# EasyEDA Pro project ProPrj_ZC95_FrontPanelControls_v1_1.epro

# Schematic Schematic1
Board Name: Board1; Create Date: 2026-02-20; Page Name: P1; Project Name: ZC95_FrontPanelControls_v1_1; Schematic Name: Schematic1; Update Date: 2026-08-01; Company: EasyEDA.com; Page Size: A4; Version: V1.1
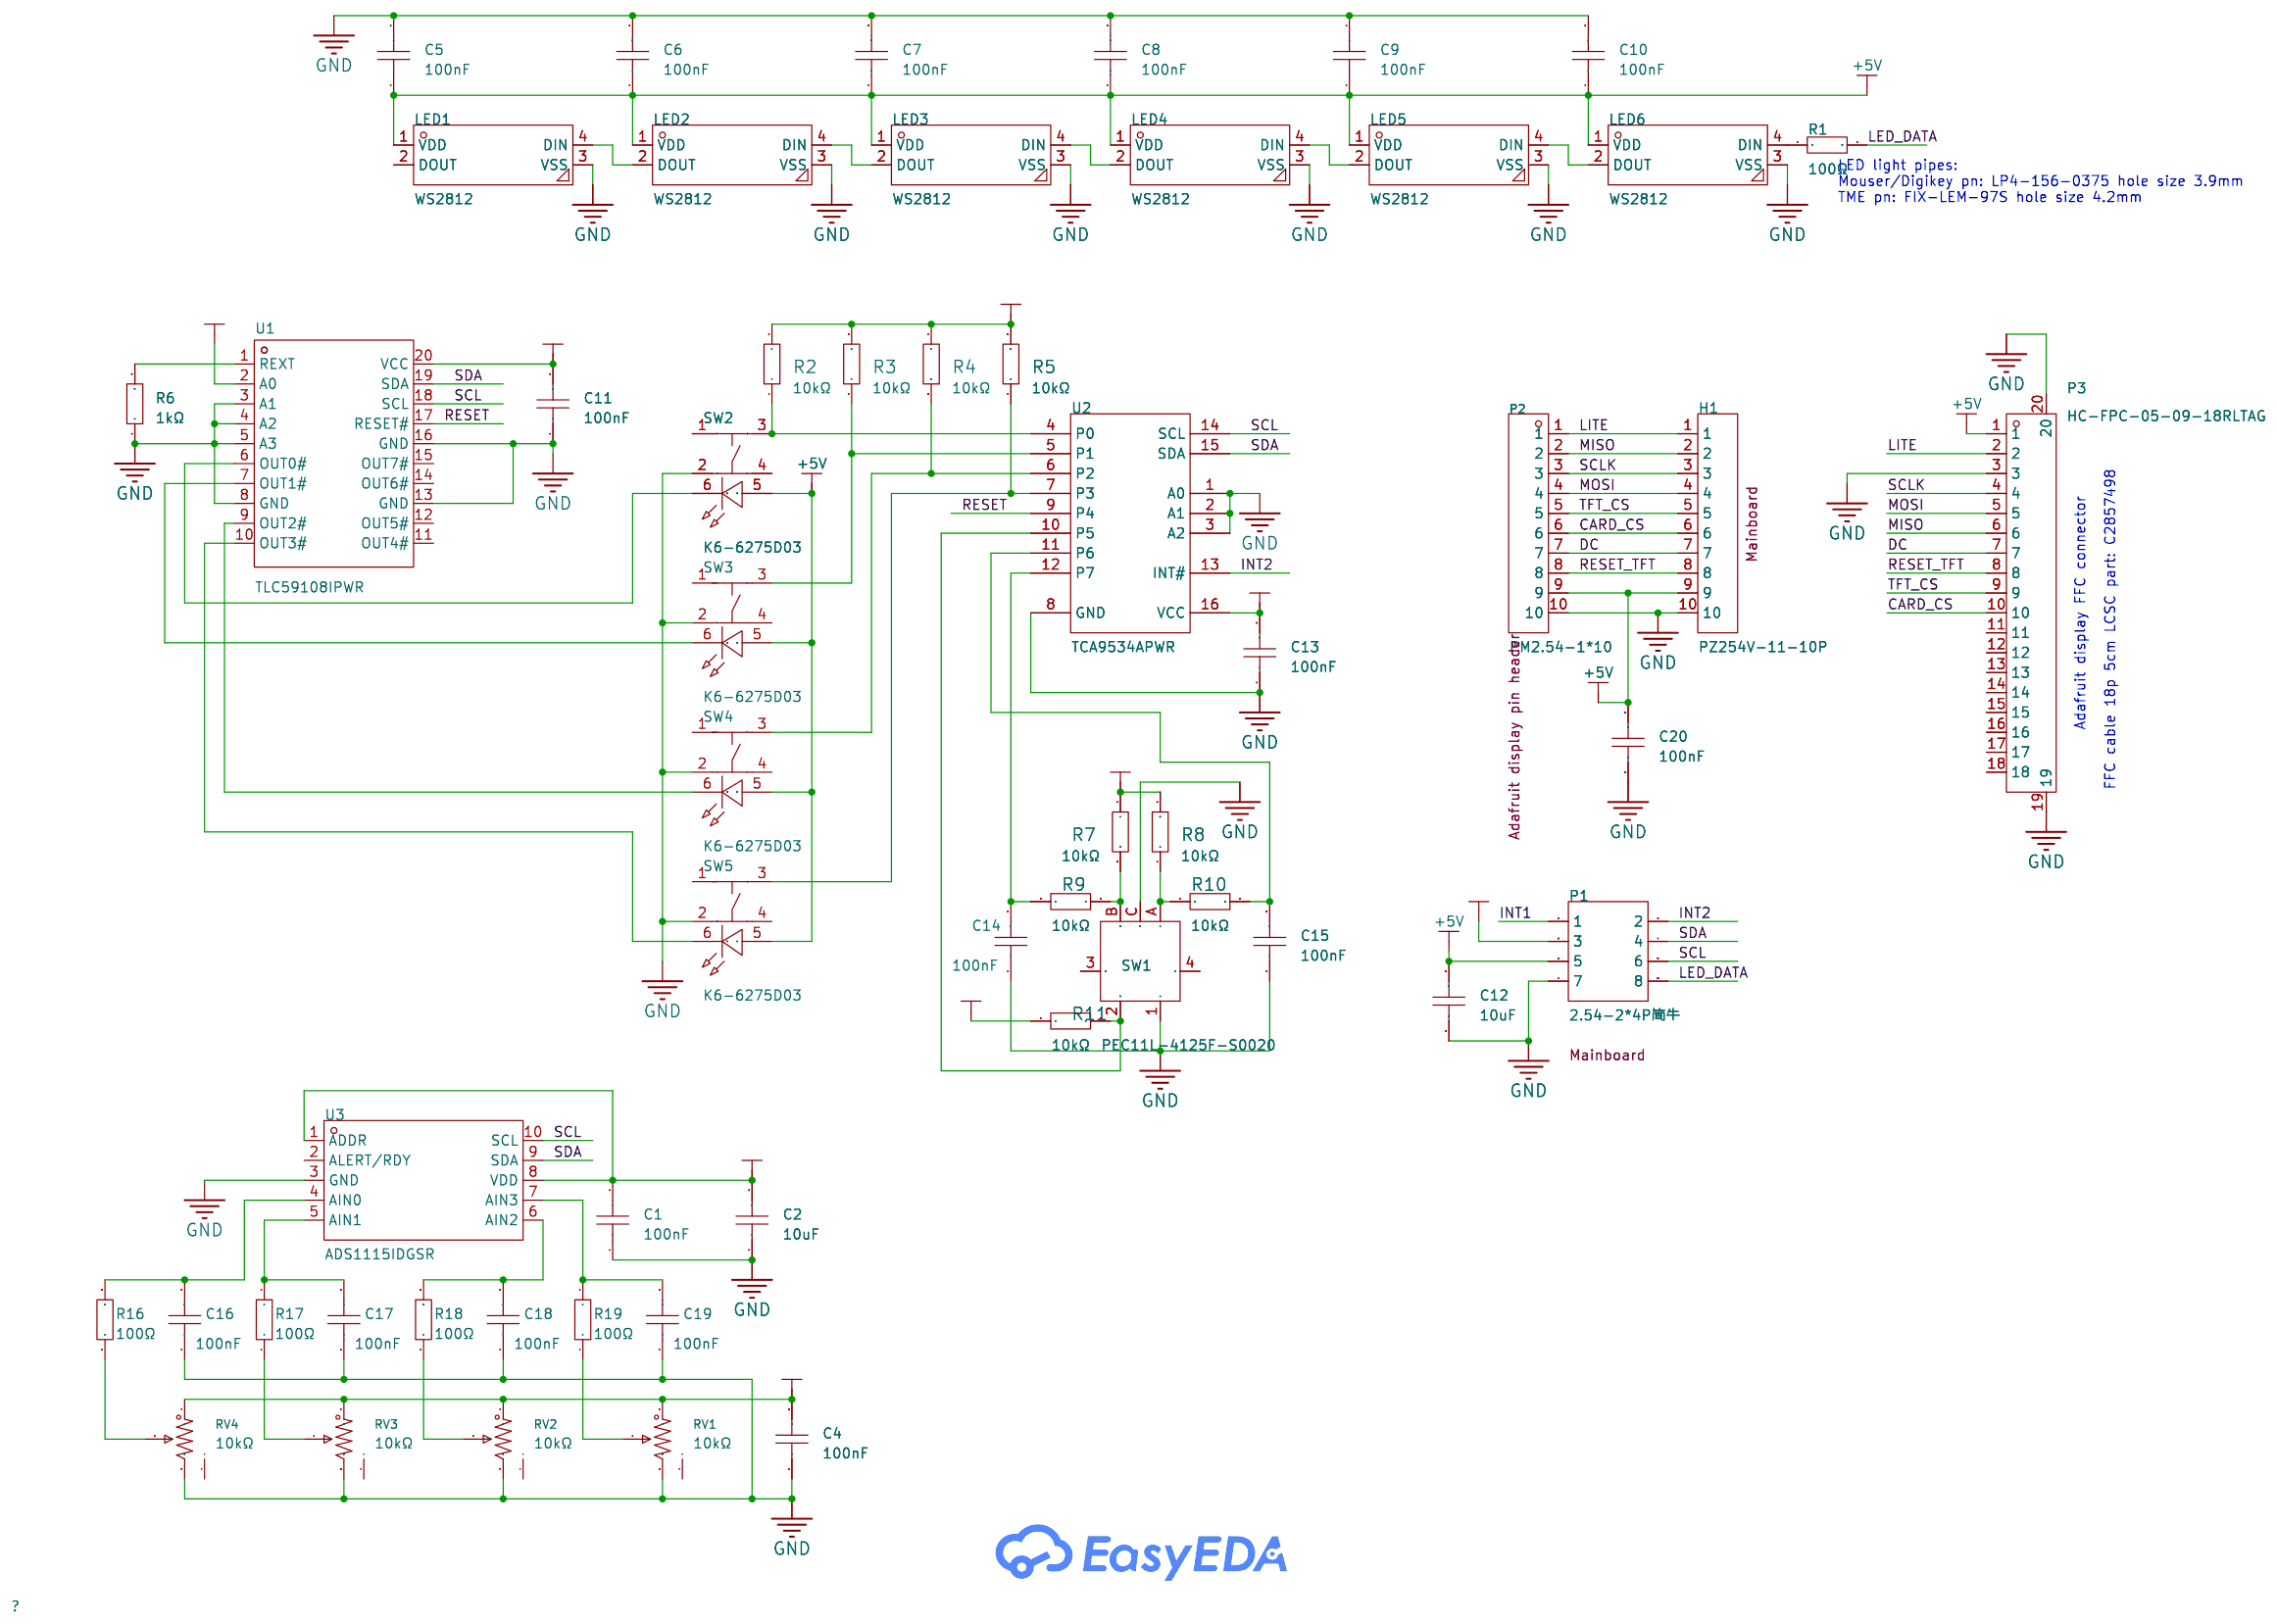
[diagram p0: schematic sheet]

## Parts
C1  100nF  [C0603]
C2  10uF  [C0603]
C4  100nF  [C0603]
C5  100nF  [C0603]
C6  100nF  [C0603]
C7  100nF  [C0603]
C8  100nF  [C0603]
C9  100nF  [C0603]
C10  100nF  [C0603]
C11  100nF  [C0603]
C12  10uF  [C0603]
C13  100nF  [C0603]
C14  100nF  [C0603]
C15  100nF  [C0603]
C16  100nF  [C0603]
C17  100nF  [C0603]
C18  100nF  [C0603]
C19  100nF  [C0603]
C20  100nF  [C0603]
H1  PZ254V-11-10P  [HDR-TH_10P-P2.54-V-M]
LED1  WS2812  [LED-SMD_4P-L5.0-W5.0-TL_WS2812B-B]
LED2  WS2812  [LED-SMD_4P-L5.0-W5.0-TL_WS2812B-B]
LED3  WS2812  [LED-SMD_4P-L5.0-W5.0-TL_WS2812B-B]
LED4  WS2812  [LED-SMD_4P-L5.0-W5.0-TL_WS2812B-B]
LED5  WS2812  [LED-SMD_4P-L5.0-W5.0-TL_WS2812B-B]
LED6  WS2812  [LED-SMD_4P-L5.0-W5.0-TL_WS2812B-B]
P1  2.54-2*4P简牛  [IDC-TH_8P-P2.54-V-R2-C4-S2.54]
P2  PM2.54-1*10  [HDR-TH_10P-P2.54-V-F]
P3  HC-FPC-05-09-18RLTAG  [FPC-SMD_18P-P0.50_HC-FPC-05-09-18RLTAG]
R1  100Ω  [R0603]
R2  10kΩ  [R0603]
R3  10kΩ  [R0603]
R4  10kΩ  [R0603]
R5  10kΩ  [R0603]
R6  1kΩ  [R0603]
R7  10kΩ  [R0603]
R8  10kΩ  [R0603]
R9  10kΩ  [R0603]
R10  10kΩ  [R0603]
R11  10kΩ  [R0603]
R16  100Ω  [R0603]
R17  100Ω  [R0603]
R18  100Ω  [R0603]
R19  100Ω  [R0603]
RV1  10kΩ  [RES-ADJ-TH_RK09L1140A65]
RV2  10kΩ  [RES-ADJ-TH_RK09L1140A65]
RV3  10kΩ  [RES-ADJ-TH_RK09L1140A65]
RV4  10kΩ  [RES-ADJ-TH_RK09L1140A65]
SW1  PEC11L-4125F-S0020  [SW-TH_PEC11L-4125F-S0020]
SW2  K6-6275D03  [SW-TH_K6-6275D03]
SW3  K6-6275D03  [SW-TH_K6-6275D03]
SW4  K6-6275D03  [SW-TH_K6-6275D03]
SW5  K6-6275D03  [SW-TH_K6-6275D03]
U1  TLC59108IPWR  [TSSOP-20_L6.5-W4.4-P0.65-LS6.4-BL]
U2  TCA9534APWR  [TSSOP-16_L5.0-W4.4-P0.65-LS6.4-BL]
U3  ADS1115IDGSR  [MSOP-10_L3.0-W3.0-P0.50-LS5.0-BL]

## Library data of the parts
C1 C4-C11 C13-C20 = CC0603KRX7R9BB104: Capacitance:100nF Tolerance:±10% Tolerance:±10% Voltage Rating:50V Temperature Coefficient:X7R; LCSC Part Name: 100nF ±10% 50V; Supplier Part: C14663; Manufacturer: YAGEO(国巨); Supplier Footprint: 0603; JLCPCB Part Class: Basic Part; Datasheet: https://item.szlcsc.com/datasheet/CC0603KRX7R9BB104/15331.html; Supplier: LCSC; Tolerance: ±10%; Voltage Rating: 50V; Temperature Coefficient: X7R
C2 C12 = CL10A106KP8NNNC: Capacitance:10uF Tolerance:±10% Tolerance:±10% Voltage Rating:10V Temperature Coefficient:X5R; LCSC Part Name: 10uF ±10% 10V; Supplier Part: C19702; Manufacturer: SAMSUNG(三星); Supplier Footprint: 0603; JLCPCB Part Class: Basic Part; Datasheet: https://item.szlcsc.com/datasheet/CL10A106KP8NNNC/20411.html; Supplier: LCSC; Tolerance: ±10%; Voltage Rating: 10V; Temperature Coefficient: X5R
H1 = PZ254V-11-10P: Pin Structure:1x10P Pitch:2.54mm Row Spacing:- Circluar Pins/Square Pins:Policy Mounting Type:Straight Number of Rows:Single Row Number of Pins:10P Current Rating:- Voltage Rating (Max):- Length of Mating Pin:6mm Insulation Height:2.5mm Length of End Conn; LCSC Part Name: 1x10P 间距:2.54mm 方针 直插; Supplier Part: C492409; Manufacturer: XFCN(兴飞); Supplier Footprint: 插件,P=2.54mm; JLCPCB Part Class: Extended Part; Datasheet: https://atta.szlcsc.com/upload/public/pdf/source/20200309/C492409_129C9431BDD62EBBBD0A643B6AAB9FBD.pdf; Supplier: LCSC; Pin Structure: 1x10P; Pitch: 2.54mm; Circluar Pins/Square Pins: Policy; Mounting Type: Straight; Number of Rows: Single Row; Number of Pins: 10P; Length of Mating Pin: 6mm; Insulation Height: 2.5mm; Length of End Connection Pin: 3mm; Contact Material: Brass; Operating Temperature: -40℃~+105℃; Color: Black; Comment: Mainboard
LED1-LED6 = WS2812B-B/T: Wavelength:520nm；471nm；621nm Luminous Intensity:R:300mcd~500mcd；B:200mcd~300mcd；G:600mcd~1000mcd Fixed-Frequency Pwm Mode:2kHz Data Transmission Rate:800Kbit/s Voltage - Supply:- Voltage - Supply:- Quiescent Current:0.6mA Lens Color:- Peak Wavelength:G:52; LCSC Part Name: RGB三色; Supplier Part: C5380881; Manufacturer: worldsemi; Supplier Footprint: SMD5050-4P; JLCPCB Part Class: Extended Part; Datasheet: https://item.szlcsc.com/datasheet/WS2812B-B%252FT/2886707.html; Supplier: LCSC; Wavelength: 520nm；471nm；621nm; Luminous Intensity: R:300mcd~500mcd；B:200mcd~300mcd；G:600mcd~1000mcd; Fixed-Frequency Pwm Mode: 2kHz; Data Transmission Rate: 800Kbit/s; Quiescent Current: 0.6mA; Peak Wavelength: G:520nm；R:621nm；B:471nm; Length: 5mm; Width: 1.57mm; Height: 5.4mm; Check: false
P1 = 2.54-2*4P简牛: Connector Type:IDC Header Pitch:2.54mm Number of Positions or Pins:2x4P Current Rating:1A Holder Type:Through Hole Row Spacing:2.54mm Number of Rows:2 Number of PINs Per Row:4 Contact Material:Brass Contact Plating:Gold Operating Temperature:-55℃~+105℃ Op; LCSC Part Name: 2.54mm 2x4P 排数:2 每排P数:4; Supplier Part: C9135; Manufacturer: BOOMELE(博穆精密); Supplier Footprint: 插件,P=2.54mm; JLCPCB Part Class: Extended Part; Datasheet: https://item.szlcsc.com/datasheet/2.54-2*4P%25E7%25AE%2580%25E7%2589%259B/9658.html; Supplier: LCSC; Connector Type: IDC Header; Pitch: 2.54mm; Number of Positions or Pins: 2x4P; Current Rating: 1A; Holder Type: Through Hole; Row Spacing: 2.54mm; Number of Rows: 2; Number of PINs Per Row: 4; Contact Material: Brass; Contact Plating: Gold; Operating Temperature: -55℃~+105℃; Color: Black; Comment: Mainboard
P2 = PM2.54-1*10: Holes Structure:1x10P Pitch:2.54mm Row Spacing:2.54mm Circular Hole / Square Hole:Square Hole Mounting Type:Through Hole Number of Rows:1 Number of Positions:10P Current Rating:2.5A Holes Direction:Top Insulation Height:8.5mm Operating Temperature:-40℃~+1; LCSC Part Name: 间距:2.54mm 1x10P 直插; Supplier Part: C5116489; Manufacturer: ZHOURI(洲日); Supplier Footprint: 插件,P=2.54mm; JLCPCB Part Class: Extended Part; Datasheet: https://item.szlcsc.com/datasheet/PM2.54-1*10/5692732.html; Supplier: LCSC; Holes Structure: 1x10P; Pitch: 2.54mm; Row Spacing: 2.54mm; Circular Hole / Square Hole: Square Hole; Mounting Type: Through Hole; Number of Rows: 1; Number of Positions: 10P; Current Rating: 2.5A; Holes Direction: Top; Insulation Height: 8.5mm; Operating Temperature: -40℃~+105℃; Comment: Adafruit display pin header
P3 = HC-FPC-05-09-18RLTAG: Locking Feature:Clamshell Contact Type:Double-sided contacts/up and down connection Number of Contacts:18P Pitch:0.5mm Mounting Type:卧贴 FFC, FCB Thickness:0.3mm FFC, FCB Thickness:0.3mm Height Above Board:1mm Contact Material:Copper Alloy Operating Temper; LCSC Part Name: 翻盖式 双侧触点/上下接 P数:18P 间距:0.5mm; Supplier Part: C5213754; Manufacturer: HCTL(华灿天禄); Supplier Footprint: SMD,P=0.5mm,卧贴; JLCPCB Part Class: Extended Part; Datasheet: https://atta.szlcsc.com/upload/public/pdf/source/20221026/52A26161A88FCE07A06989F8D4399614.pdf; Supplier: LCSC; Locking Feature: Clamshell; Contact Type: Double-sided contacts/up and down connection; Number of Contacts: 18P; Pitch: 0.5mm; Mounting Type: 卧贴; FFC, FCB Thickness: 0.3mm; Height Above Board: 1mm; Contact Material: Copper Alloy; Operating Temperature Range: -55℃~+85℃
R1 R16-R19 = 0603WAF1000T5E: Type:Thick Film Resistors Resistance: Tolerance:±1% Tolerance:±1% Power(Watts): Overload Voltage (Max): Temperature Coefficient:±200ppm/℃ Temperature Coefficient:±200ppm/℃ Operating Temperature Range:-55℃~+155℃ Operating Temperature Range:-55℃~+155℃; LCSC Part Name: 100Ω ±1% 100mW 厚膜电阻; Supplier Part: C22775; Manufacturer: UNI-ROYAL(厚声); Supplier Footprint: 0603; JLCPCB Part Class: Basic Part; Datasheet: https://atta.szlcsc.com/upload/public/pdf/source/20200306/C422600_1E6D84923E4A46A82E41ADD87F860B5C.pdf; Supplier: LCSC; Type: Thick Film Resistors; Tolerance: ±1%; Temperature Coefficient: ±200ppm/℃; Operating Temperature Range: -55℃~+155℃
R2-R5 R7-R11 = 0603WAF1002T5E: Type:Thick Film Resistor Resistance:10kΩ Tolerance:±1% Tolerance:±1% Power(Watts):100mW Voltage-Supply(Max):75V Temperature Coefficient:±100ppm/℃ Temperature Coefficient:±100ppm/℃ Operating Temperature:-55℃~+155℃ Operating Temperature:-55℃~+155℃; LCSC Part Name: 厚膜电阻 10kΩ ±1% 100mW; Supplier Part: C25804; Manufacturer: UNI-ROYAL(厚声); Supplier Footprint: 0603; JLCPCB Part Class: Basic Part; Datasheet: https://item.szlcsc.com/datasheet/0603WAF1002T5E/26547.html; Supplier: LCSC; Type: Thick Film Resistor; Tolerance: ±1%; Power(Watts): 100mW; Voltage-Supply(Max): 75V; Temperature Coefficient: ±100ppm/℃; Operating Temperature: -55℃~+155℃
R6 = 0603WAF1001T5E: Type:Thick Film Resistor Resistance:1kΩ Tolerance:±1% Tolerance:±1% Power(Watts):100mW Voltage-Supply(Max):75V Temperature Coefficient:±100ppm/℃ Temperature Coefficient:±100ppm/℃ Operating Temperature:-55℃~+155℃ Operating Temperature:-55℃~+155℃; LCSC Part Name: 1kΩ ±1% 100mW 厚膜电阻; Supplier Part: C21190; Manufacturer: UNI-ROYAL(厚声); Supplier Footprint: 0603; JLCPCB Part Class: Basic Part; Datasheet: https://item.szlcsc.com/datasheet/0603WAF1001T5E/21904.html; Supplier: LCSC; Type: Thick Film Resistor; Tolerance: ±1%; Power(Watts): 100mW; Voltage-Supply(Max): 75V; Temperature Coefficient: ±100ppm/℃; Operating Temperature: -55℃~+155℃
RV1-RV4 = RK09L1140A2U: Resistance:10kΩ Tolerance:±20% Tolerance:±20% Voltage Rating:10V Power(Watts):50mW Number of Turns:-; LCSC Part Name: 三件套 10kΩ ±20%; Supplier Part: C470448; Manufacturer: ALPSALPINE(阿尔卑斯阿尔派); Supplier Footprint: 插件; JLCPCB Part Class: Extended Part; Datasheet: https://item.szlcsc.com/datasheet/RK09L1140A2U/476528.html; Supplier: LCSC; Tolerance: ±20%; Voltage Rating: 10V; Power(Watts): 50mW
SW1 = PEC11L-4125F-S0020: LCSC Part Name: 三件套 PEC11L-4125F-S0020（三件套）; Supplier Part: C143783; Manufacturer: BOURNS; Supplier Footprint: 插件; JLCPCB Part Class: Extended Part; Datasheet: https://item.szlcsc.com/datasheet/PEC11L-4125F-S0020/155114.html; Supplier: LCSC
SW2-SW5 = K6-6275D03: Operating Force:1.6N Mounting Type:Through Hole Length:9mm Width:9mm Switch Height:15.35mm Contact Current:50mA Voltage Rating:12V With Lamp:Blue Life:100,000 Cycles Operating Temperature:-25℃~+85℃ Operating Temperature:-25℃~+85℃; LCSC Part Name: 蓝色带灯开关; Supplier Part: C693828; Manufacturer: 韩国韩荣; Supplier Footprint: 插件,9x9mm; JLCPCB Part Class: Extended Part; Datasheet: https://item.szlcsc.com/datasheet/K6-6275D03/726368.html; Supplier: LCSC; Operating Force: 1.6N; Mounting Type: Through Hole; Length: 9mm; Width: 9mm; Switch Height: 15.35mm; Contact Current: 50mA; Voltage Rating: 12V; With Lamp: Blue; Life: 100,000 Cycles; Operating Temperature: -25℃~+85℃
U1 = TLC59108IPWR: Type:- Voltage - Input(DC):3V~5.5V Voltage - Input(DC):3V~5.5V Frequency - Switching:25MHz Frequency - Switching:25MHz Number of Channels:8 Output Voltage:17V Output Voltage:17V Output Current:120mA Dimming:PWM；I2C Features:Over-Temperature Protection (OT; LCSC Part Name: 8位调频+ I²C总线恒流LED灌电流驱动器; Supplier Part: C130031; Manufacturer: TI(德州仪器); Supplier Footprint: TSSOP-20; JLCPCB Part Class: Extended Part; Datasheet: https://www.ti.com/cn/lit/gpn/tlc59108; Supplier: LCSC; Voltage - Input(DC): 3V~5.5V; Frequency - Switching: 25MHz; Number of Channels: 8; Output Voltage: 17V; Output Current: 120mA; Dimming: PWM；I2C; Features: Over-Temperature Protection (OTP); Operating temperature: -40℃~+85℃; Switch Tube (Built-In/External): Built-in; Constant Current Accuracy: 8%
U2 = TCA9534APWR: Interface:I2C；SMBus Number of I/O:8 Interrupt Output:With Interrupt Output Output Type:- Voltage - Supply:1.65V~5.5V Voltage - Supply:1.65V~5.5V Current - Output Low(IOL):- Current - Output High(IOH):- Clock Frequency:400kHz Operating Temperature:-40℃~+85; LCSC Part Name: TCA9534A 低电压8位I²C和SMBUS低功耗I/O扩展器，带中断输出和配置寄存器; Supplier Part: C206010; Manufacturer: TI(德州仪器); Supplier Footprint: TSSOP-16; JLCPCB Part Class: Extended Part; Datasheet: https://www.ti.com/cn/lit/gpn/tca9534a; Supplier: LCSC; Interface: I2C；SMBus; Number of I/O: 8; Interrupt Output: With Interrupt Output; Voltage - Supply: 1.65V~5.5V; Clock Frequency: 400kHz; Operating Temperature: -40℃~+85℃
U3 = ADS1115IDGSR: Resolution(Bits):16 Sampling Rate:- number of channels:2 Voltage - Supply:2V~5.5V Voltage - Supply:2V~5.5V Interface:I2C differential input:Yes Integral non - linearity:1LSB Integral non - linearity:1LSB Operating Temperature:-40℃~+125℃ Operating Temperat; LCSC Part Name: 具有内部基准、振荡器和可编程比较器且兼容 I2C 的ADS111x、超小型、低功耗 860SPS、16位ADC; Supplier Part: C37593; Manufacturer: TI(德州仪器); Supplier Footprint: VSSOP-10; JLCPCB Part Class: Extended Part; Datasheet: https://www.ti.com/cn/lit/gpn/ads1115; Supplier: LCSC; Resolution(Bits): 16; number of channels: 2; Voltage - Supply: 2V~5.5V; Interface: I2C; differential input: Yes; Integral non - linearity: 1LSB; Operating Temperature: -40℃~+125℃; Clock/Oscillator: Built-in; Voltage Reference: Built-in; Programmable Gain: Support; ADC architecture: Sigma-Delta; Data rate: 128Hz；8Hz；64Hz；16Hz；32Hz；250Hz；475Hz；860Hz; Quiescent Current (Iq): 500nA; Full-Scale Range(FSR): 2.048V

## Nets
+3V3: C1.2 C2.2 C4.2 C11.2 C13.2 P1.3 R2.2 R3.2 R4.1 R5.2 R7.1 R8.2 R11.1 RV1.1 RV2.1 RV3.1 RV4.1 U1.2(A0) U1.20(VCC) U2.16(VCC) U3.1(ADDR) U3.8(VDD)
+5V: C5.1 C6.1 C7.1 C8.1 C9.1 C10.1 C12.2 C20.2 H1.9 LED1.1(VDD) LED2.1(VDD) LED3.1(VDD) LED4.1(VDD) LED5.1(VDD) LED6.1(VDD) P1.5 P2.9 P3.1 SW2.5 SW3.5 SW4.5 SW5.5
GND: C1.1 C2.1 C4.1 C5.2 C6.2 C7.2 C8.2 C9.2 C10.2 C11.1 C12.1 C13.1 C14.1 C15.1 C16.1 C17.1 C18.1 C19.1 C20.1 H1.10 LED1.3(VSS) LED2.3(VSS) LED3.3(VSS) LED4.3(VSS) LED5.3(VSS) LED6.3(VSS) P1.7 P2.10 P3.3 P3.19 P3.20 R6.1 RV1.3 RV2.3 RV3.3 RV4.3 SW1.1 SW1.C SW2.2 SW3.2 SW4.2 SW5.2 U1.3(A1) U1.4(A2) U1.5(A3) U1.8(GND) U1.13(GND) U1.16(GND) U2.1(A0) U2.2(A1) U2.3(A2) U2.8(GND) U3.3(GND)
CARD_CS: H1.6 P2.6 P3.10
DC: H1.7 P2.7 P3.7
INT1: P1.1
INT2: P1.2 U2.13(INT#)
LED_DATA: P1.8 R1.2
LITE: H1.1 P2.1 P3.2
MISO: H1.2 P2.2 P3.6
MOSI: H1.4 P2.4 P3.5
RESET: U1.17(RESET#) U2.9(P4)
RESET_TFT: H1.8 P2.8 P3.8
SCL: P1.6 U1.18(SCL) U2.14(SCL) U3.10(SCL)
SCLK: H1.3 P2.3 P3.4
SDA: P1.4 U1.19(SDA) U2.15(SDA) U3.9(SDA)
TFT_CS: H1.5 P2.5 P3.9
$1N1414: LED6.4(DIN) R1.1
$1N1465: LED5.4(DIN) LED6.2(DOUT)
$1N1471: LED4.4(DIN) LED5.2(DOUT)
$1N1478: LED3.4(DIN) LED4.2(DOUT)
$1N1485: LED2.4(DIN) LED3.2(DOUT)
$1N1492: LED1.4(DIN) LED2.2(DOUT)
$1N2339: C16.2 R16.2 U3.4(AIN0)
$1N2349: C17.2 R17.2 U3.5(AIN1)
$1N2354: C18.2 R18.2 U3.6(AIN2)
$1N3651: R6.2 U1.1(REXT)
$1N3862: R11.2 SW1.2 U2.10(P5)
$1N3864: R7.2 R9.2 SW1.B
$1N3866: R8.1 R10.1 SW1.A
$1N3870: C15.2 R10.2 U2.11(P6)
$1N3872: C14.2 R9.1 U2.12(P7)
$1N4065: R2.1 SW2.3 U2.4(P0)
$1N4070: R3.1 SW3.3 U2.5(P1)
$1N4076: R4.2 SW4.3 U2.6(P2)
$1N4082: R5.1 SW5.3 U2.7(P3)
$1N4405: SW2.6 U1.6(OUT0#)
$1N4413: SW3.6 U1.7(OUT1#)
$1N4423: SW4.6 U1.9(OUT2#)
$1N4431: SW5.6 U1.10(OUT3#)
$1N7663: C19.2 R19.2 U3.7(AIN3)
$1N7666: R19.1 RV1.2
$1N7676: R16.1 RV4.2
$1N7681: R17.1 RV3.2
$1N7687: R18.1 RV2.2

Not connected (* = marked no-connect by the designer): LED1 2(DOUT); P3 11 12 13 14 15 16 17 18; RV1 4; RV2 4; RV3 4; RV4 4; SW1 3 4; SW2 1 4; SW3 1 4; SW4 1 4; SW5 1 4; U1 11(OUT4#) 12(OUT5#) 14(OUT6#) 15(OUT7#); U3 2(ALERT/RDY)

## Notes on the sheet
- LED light pipes:
  Mouser/Digikey pn: LP4-156-0375 hole size 3.9mm
  TME pn: FIX-LEM-97S hole size 4.2mm
- Adafruit display FFC connector
- FFC cable 18p 5cm LCSC part: C2857498

# Board PCB1
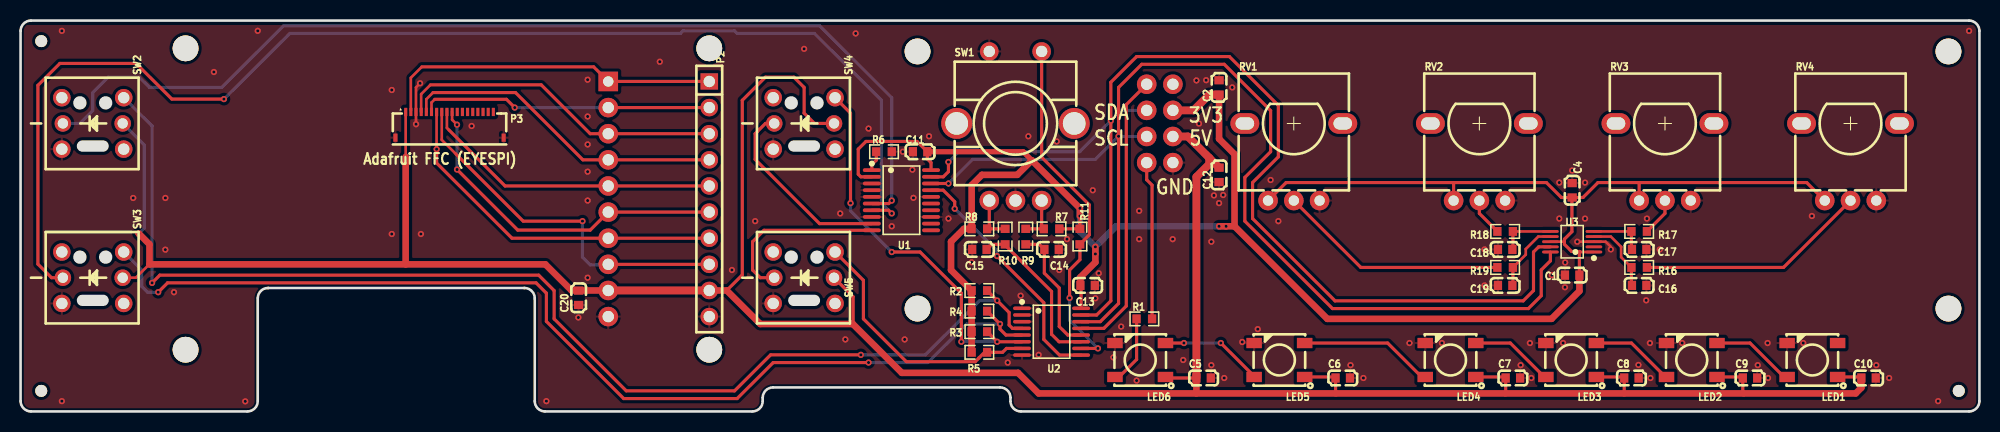
[diagram p1: board, top side]
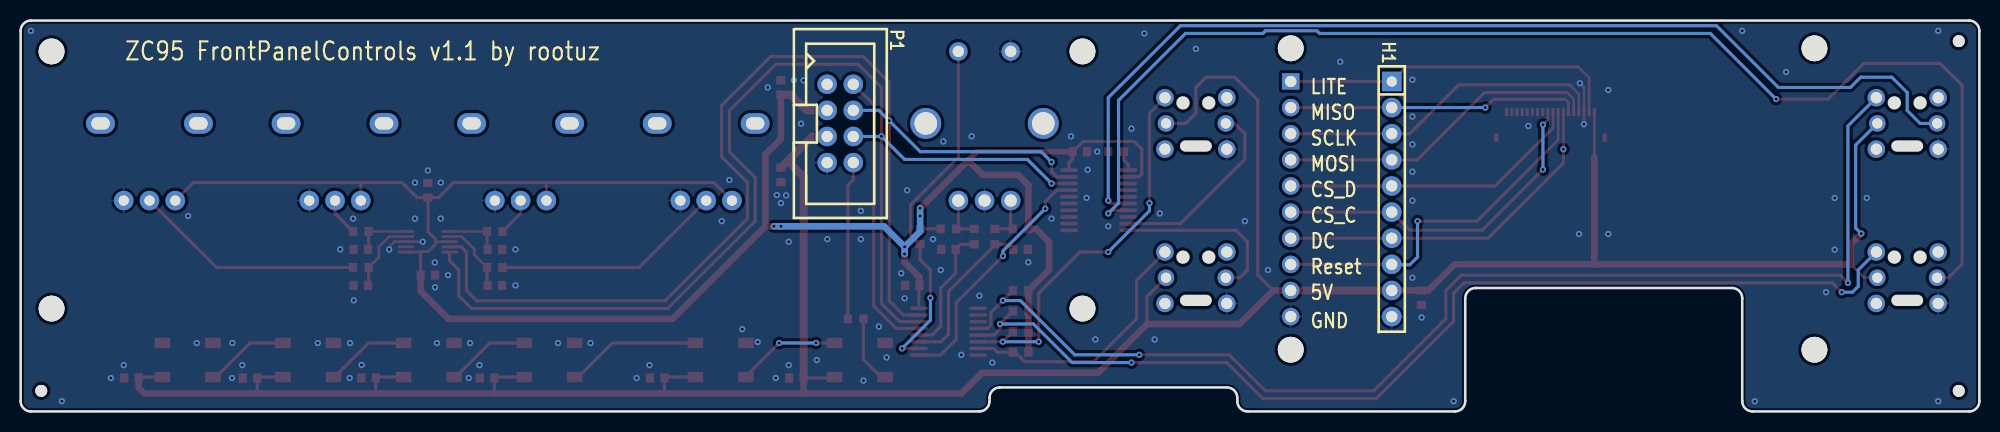
[diagram p2: board, bottom side, seen from below]

Outline 190 x 38 mm; copper layers: Top Layer, Bottom Layer. Coordinates in mm from the lower left corner of the outline.
Outline path: 0,37 arc(0.29,37.71) 1,38 189,38 arc(189.71,37.71) 190,37 190,1 arc(189.71,0.29) 189,0 97.02,0 arc(96.31,0.29) 96.02,1 96.02,1.33 arc(95.72,2.04) 95.02,2.33 72.98,2.33 arc(72.27,2.04) 71.98,1.33 71.98,1 arc(71.69,0.29) 70.98,0 50.87,0 arc(50.16,0.29) 49.87,1 49.87,11 arc(49.58,11.71) 48.87,12 24,12 arc(23.29,11.71) 23,11 23,1 arc(22.71,0.29) 22,0 1,0 arc(0.29,0.29) 0,1 0,37
Stack: Top Layer 0.035mm / Dielectric1 1.51mm FR4 er 4.5 / Bottom Layer 0.035mm

## Design rules (mm)
template: Custom Config
spacing copperThickness1oz (default): track to track 0.102, other pairs 0.152 to 0.3
spacing copperThickness2oz: track to track 0.203, other pairs 0.152 to 0.3
track width copperThickness1oz (default): min 0.127, default 0.305, max 2.54
track width copperThickness2oz: min 0.203, default 0.254, max 2.54
differential pair differentialPair (default): width min 0.127, default 0.254, max 2.54; gap min 0.152, default 0.152
via viaSize (default): diameter min 0.5, default 0.61, max 10; hole min 0.3, default 0.305, max 6.3

## Placement (name value [footprint] x y rotation side)
C1  100nF  [C0603]  150.5 13.25 0 top
C2  10uF  [C0603]  116.25 31.5 270 top
C4  100nF  [C0603]  150.5 21.5 270 top
C5  100nF  [C0603]  114.75 3.25 0 top
C6  100nF  [C0603]  128.25 3.25 0 top
C7  100nF  [C0603]  144.75 3.25 0 top
C8  100nF  [C0603]  156.25 3.25 0 top
C9  100nF  [C0603]  167.75 3.25 0 top
C10  100nF  [C0603]  179.25 3.25 0 top
C11  100nF  [C0603]  87.25 25.25 0 top
C12  10uF  [C0603]  116.25 23 90 top
C13  100nF  [C0603]  103.5 12.25 180 top
C14  100nF  [C0603]  100 15.75 180 top
C15  100nF  [C0603]  93 15.75 0 top
C16  100nF  [C0603]  157 12.25 180 top
C17  100nF  [C0603]  157 15.75 180 top
C18  100nF  [C0603]  144 15.75 0 top
C19  100nF  [C0603]  144 12.25 0 top
C20  100nF  [C0603]  54.13 11.05 90 top
H1  PZ254V-11-10P  [HDR-TH_10P-P2.54-V-M]  57 20.65 270 bottom
LED1  WS2812  [LED-SMD_4P-L5.0-W5.0-TL_WS2812B-B]  173.8 5 180 top
LED2  WS2812  [LED-SMD_4P-L5.0-W5.0-TL_WS2812B-B]  162.1 5 180 top
LED3  WS2812  [LED-SMD_4P-L5.0-W5.0-TL_WS2812B-B]  150.4 5 180 top
LED4  WS2812  [LED-SMD_4P-L5.0-W5.0-TL_WS2812B-B]  138.7 5 180 top
LED5  WS2812  [LED-SMD_4P-L5.0-W5.0-TL_WS2812B-B]  122.1 5 180 top
LED6  WS2812  [LED-SMD_4P-L5.0-W5.0-TL_WS2812B-B]  108.6 5 180 top
NOREF  -  [Pad_e55]  16 35.3 0 top
NOREF#2  -  [Pad_e473]  2 36 0 top
NOREF#3  -  [Pad_e54]  66.8 6 0 top
NOREF#4  -  [Pad_e485]  188 2 0 top
NOREF#5  -  [Pad_e484]  2 2 0 top
NOREF#6  -  [Pad_e68]  87 10 0 top
NOREF#7  -  [Pad_e56]  16 6 0 top
NOREF#8  -  [Pad_e53]  66.8 35.3 0 top
NOREF#9  -  [Pad_e66]  187 10 0 top
NOREF#10  -  [Pad_e67]  87 35 0 top
NOREF#11  -  [Pad_e64]  187 35 0 top
P1  2.54-2*4P简牛  [IDC-TH_8P-P2.54-V-R2-C4-S2.54]  110.5 28 270 bottom
P2  PM2.54-1*10  [HDR-TH_10P-P2.54-V-F]  66.8 20.65 270 top
P3  HC-FPC-05-09-18RLTAG  [FPC-SMD_18P-P0.50_HC-FPC-05-09-18RLTAG]  41.61 27.87 180 top
R1  100Ω  [R0603]  109 9 0 top
R2  10kΩ  [R0603]  93 11.75 180 top
R3  10kΩ  [R0603]  93 9.75 180 top
R4  10kΩ  [R0603]  93 7.75 0 top
R5  10kΩ  [R0603]  93 5.75 180 top
R6  1kΩ  [R0603]  83.75 25.25 180 top
R7  10kΩ  [R0603]  100 17.75 180 top
R8  10kΩ  [R0603]  93 17.75 180 top
R9  10kΩ  [R0603]  97.5 17 90 top
R10  10kΩ  [R0603]  95.5 17 270 top
R11  10kΩ  [R0603]  102.75 17 270 top
R16  100Ω  [R0603]  157 14 180 top
R17  100Ω  [R0603]  157 17.5 180 top
R18  100Ω  [R0603]  144 17.5 0 top
R19  100Ω  [R0603]  144 14 0 top
RV1  10kΩ  [RES-ADJ-TH_RK09L1140A65]  123.5 28 0 top
RV2  10kΩ  [RES-ADJ-TH_RK09L1140A65]  141.5 28 0 top
RV3  10kΩ  [RES-ADJ-TH_RK09L1140A65]  159.5 28 0 top
RV4  10kΩ  [RES-ADJ-TH_RK09L1140A65]  177.5 28 0 top
SW1  PEC11L-4125F-S0020  [SW-TH_PEC11L-4125F-S0020]  96.5 28 0 top
SW2  K6-6275D03  [SW-TH_K6-6275D03]  7 28 270 top
SW3  K6-6275D03  [SW-TH_K6-6275D03]  7 13 270 top
SW4  K6-6275D03  [SW-TH_K6-6275D03]  76 28 270 top
SW5  K6-6275D03  [SW-TH_K6-6275D03]  76 13 270 top
U1  TLC59108IPWR  [TSSOP-20_L6.5-W4.4-P0.65-LS6.4-BL]  85.44 20.53 270 top
U2  TCA9534APWR  [TSSOP-16_L5.0-W4.4-P0.65-LS6.4-BL]  100 7.75 270 top
U3  ADS1115IDGSR  [MSOP-10_L3.0-W3.0-P0.50-LS5.0-BL]  150.5 16.5 90 top

## Footprints (pads in the part's own frame, mm; a bottom-side part is the same pattern mirrored in y, then rotated)
C0603
  rect 0.8x0.9 smd: 1(-0.7,0) 2(0.7,0)
FPC-SMD_18P-P0.50_HC-FPC-05-09-18RLTAG
  rect 0.3x0.8 smd: 1(4.25,-1.25) 2(3.75,-1.25) 3(3.25,-1.25) 4(2.75,-1.25) 5(2.25,-1.25) 6(1.75,-1.25) 7(1.25,-1.25) 8(0.75,-1.25) 9(0.25,-1.25) 10(-0.25,-1.25) 11(-0.75,-1.25) 12(-1.25,-1.25) 13(-1.75,-1.25) 14(-2.25,-1.25) 15(-2.75,-1.25) 16(-3.25,-1.25) 17(-3.75,-1.25) 18(-4.25,-1.25)
  rect 0.4x0.8 smd: 19(-5.25,1.25) 20(5.25,1.25)
HDR-TH_10P-P2.54-V-F
  rect 1.575x1.7 hole 1.1: 1(-11.43,0)
  round 1.7 hole 1.1: 2(-8.89,0) 3(-6.35,0) 4(-3.81,0) 5(-1.27,0) 6(1.27,0) 7(3.81,0) 8(6.35,0) 9(8.89,0) 10(11.43,0)
HDR-TH_10P-P2.54-V-M
  rect 1.9x1.9 hole 1x1.1: 1(-11.43,0)
  round 1.9 hole 1.1x1: 2(-8.89,0) 3(-6.35,0) 4(-3.81,0) 5(-1.27,0) 6(1.27,0) 7(3.81,0) 8(6.35,0) 9(8.89,0) 10(11.43,0)
IDC-TH_8P-P2.54-V-R2-C4-S2.54
  round 1.9 hole 1.1x1: 1(-3.81,-1.27) 2(-3.81,1.27) 3(-1.27,-1.27) 4(-1.27,1.27) 5(1.27,-1.27) 6(1.27,1.27) 7(3.81,-1.27) 8(3.81,1.27)
LED-SMD_4P-L5.0-W5.0-TL_WS2812B-B
  rect 1.5x1 smd: 1(-2.45,1.65) 2(-2.45,-1.65) 3(2.45,-1.65) 4(2.45,1.65)
MSOP-10_L3.0-W3.0-P0.50-LS5.0-BL
  oval 0.28x1.62 smd: 1(-1,-2.11) 2(-0.5,-2.11) 3(0,-2.11) 4(0.5,-2.11) 5(1,-2.11) 6(1,2.11) 7(0.5,2.11) 8(0,2.11) 9(-0.5,2.11) 10(-1,2.11)
Pad_e53
  round 2.5 hole 2.5: 1(0,0)
Pad_e54
  round 2.5 hole 2.5: 1(0,0)
Pad_e55
  round 2.5 hole 2.5: 1(0,0)
Pad_e56
  round 2.5 hole 2.5: 1(0,0)
Pad_e64
  round 2.5 hole 2.5: 1(0,0)
Pad_e66
  round 2.5 hole 2.5: 1(0,0)
Pad_e67
  round 2.5 hole 2.5: 1(0,0)
Pad_e68
  round 2.5 hole 2.5: 1(0,0)
Pad_e473
  round 1.152 hole 1.152: 1(0,0)
Pad_e484
  round 1.152 hole 1.152: 1(0,0)
Pad_e485
  round 1.152 hole 1.152: 1(0,0)
R0603
  rect 0.806x0.864 smd: 1(-0.753,0) 2(0.753,0)
RES-ADJ-TH_RK09L1140A65
  round 1.9 hole 1: 1(-2.5,-7.5) 2(0,-7.5) 3(2.5,-7.5)
  oval 2.8x2 hole 1.8x1.2: 4(-4.75,0) 4(4.75,0)
SW-TH_K6-6275D03
  round 1.7 hole 1.1: 1(-2.5,-3) 2(2.5,-3) 3(-2.5,3) 4(2.5,3)
  round 1.6 hole 1: 5(0,2.9) 6(0,-2.9)
SW-TH_PEC11L-4125F-S0020
  round 1.8 hole 1.1: 1(-2.54,7) 2(2.54,7)
  round 3 hole 2.2: 3(5.7,0) 4(-5.7,0)
  round 1.9 hole 1.2: A(-2.54,-7.5) B(2.54,-7.5) C(0,-7.5)
TSSOP-16_L5.0-W4.4-P0.65-LS6.4-BL
  oval 0.343x1.732 smd: 1(-2.275,-2.866) 2(-1.625,-2.866) 3(-0.975,-2.866) 4(-0.325,-2.866) 5(0.325,-2.866) 6(0.975,-2.866) 7(1.625,-2.866) 8(2.275,-2.866) 9(2.275,2.866) 10(1.625,2.866) 11(0.975,2.866) 12(0.325,2.866) 13(-0.325,2.866) 14(-0.975,2.866) 15(-1.625,2.866) 16(-2.275,2.866)
TSSOP-20_L6.5-W4.4-P0.65-LS6.4-BL
  oval 0.364x1.742 smd: 1(-2.925,-2.871) 2(-2.275,-2.871) 3(-1.625,-2.871) 4(-0.975,-2.871) 5(-0.325,-2.871) 6(0.325,-2.871) 7(0.975,-2.871) 8(1.625,-2.871) 9(2.275,-2.871) 10(2.925,-2.871) 11(2.925,2.871) 12(2.275,2.871) 13(1.625,2.871) 14(0.975,2.871) 15(0.325,2.871) 16(-0.325,2.871) 17(-0.975,2.871) 18(-1.625,2.871) 19(-2.275,2.871) 20(-2.925,2.871)

## Nets
As in the schematic.

Pads without a net: LED1 2; NOREF 1; NOREF#2 1; NOREF#3 1; NOREF#4 1; NOREF#5 1; NOREF#6 1; NOREF#7 1; NOREF#8 1; NOREF#9 1; NOREF#10 1; NOREF#11 1; P3 11 12 13 14 15 16 17 18; RV1 4; RV2 4; RV3 4; RV4 4; SW1 3 4; SW2 1 4; SW3 1 4; SW4 1 4; SW5 1 4; U1 11 12 14 15; U3 2

## Via types
v1: diameter 0.61, hole 0.305, Top Layer to Bottom Layer, 141 vias

## Routing (per net, layer and track width the routed paths; a pad name or vN(x,y) marks a point on that pad's centre or on a via; arc(x,y) is an arc through that point)
+3V3: length 216.4
  Top Layer w0.254: 149.75,16.5 U3.8 ; U3.1 151.25,15.5
  Top Layer w0.305: C4.2 150.48,20.78 150.48,17.48 149.75,16.75 149.75,16.25 150.45,15.55 151.2,15.55 ; C4.2 151.55,20.8 153,22.25 173.25,22.25 RV4.1 ; C4.2 149.45,20.8 148,22.25 139.02,22.25 ; RV2.1 139,22.23 139.02,22.25 ; U1.2 81.5,22.81 81.25,23.06 81.25,25.5 82,26.25 86.95,26.25 C11.2 87.95,24.55 88.31,24.19 U1.20 ; 151.2,15.55 C1.2 ; 151.2,15.55 151.25,15.5 ; RV3.1 157,22.25 ; R7.1 100.76,17.75 R11.1 v1(102.75,19) ; RV1.1 122.75,22.25 139.02,22.25 ; C13.2 102.87,12.18 U2.16
  Top Layer w0.508: C11.2 97.25,25.25 98.09,24.41
  Top Layer w0.635: 117.75,18 v1(116.93,18) v1(116.25,18) ; 117.75,18 126.75,9 148.5,9 151.2,11.7 C1.2 ; 117.75,18 117.75,25 116.25,26.5 C2.2 ; v1(102.75,19) v1(102.75,19.75) 98.09,24.41 96.67,23 93.25,23 92.25,22 92.25,17.75 R8.2 91.5,17.75 90.25,16.5 90.25,13.75 R2.2 R3.2 R4.1 R5.2 ; v1(104.25,16) v1(104.25,15.31) 104.25,14.5 102.8,13.05 C13.2
  Top Layer w0.762: P1.3 113.77,29.27 115.3,30.8 C2.2
  Bottom Layer w0.635: v1(104.25,16) 106.25,18 v1(116.25,18) v1(116.93,18) ; v1(104.25,16) v1(104.25,15.31) ; v1(104.25,16) 102.75,17.5 v1(102.75,19) v1(102.75,19.75)
+5V: length 294.4
  Top Layer w0.254: SW3.5 11.18,13 12.5,14.32 ; 37.35,29.29 37.35,24.75
  Top Layer w0.305: 124.95,3.35 127.45,3.35 C6.1 127.55,1.76 127.56,1.75 ; 111.45,3.35 111.55,3.25 C5.1 ; 175.95,3.35 178.45,3.35 C10.1 ; 144.03,1.75 144.05,1.77 C7.1 143.95,3.35 141.45,3.35 ; 167.12,1.75 167.05,1.83 C9.1 166.95,3.35 164.45,3.35 ; SW5.5 80.75,11.15 80.75,8.52 80.73,8.5 ; 152.95,3.35 155.45,3.35 C8.1 155.55,1.75 155.55,1.75 ; SW4.5 77,28 76,29 76,31.5 75,32.5 72.25,32.5 70,30.25 70,13.27 68.49,11.76
  Top Layer w0.635: v1(11.45,17.28) 11.49,17.25 11.5,17.25 12.5,16.25 12.5,14.32 12.52,14.3 37.35,14.3 ; 114.05,1.75 178,1.75 178.55,2.3 C10.1 ; 114.05,1.75 98.75,1.75 96.75,3.75 85.48,3.75 80.73,8.5 71.75,8.5 68.49,11.76 67,11.76 ; 114.05,1.75 C5.1 ; H1.9 53.44,11.76 50.9,14.3 37.35,14.3 ; 37.35,14.3 37.35,24.75
  Top Layer w0.762: 67,11.76 H1.9 ; 115.3,24.65 113.22,26.73 P1.5 ; 115.3,24.65 115.3,24.05 114.05,22.8 C5.1 ; 115.3,24.65 C12.2
  Bottom Layer w0.305: SW2.5 12,25.9 12,17.83 v1(11.45,17.28)
GND: length 7.6
  Top Layer w0.254: v1(150.99,16.5) U3.3 153.75,16.5 154.25,16 ; v1(38.36,27.92) 38.35,27.93 38.35,31.5 v1(38.75,31.9)
  vias: v1(4,37) v1(4,1) v1(10.92,20.75) v1(14.04,20.75) v1(14.04,15.73) v1(14.88,11.59) v1(18.75,33) v1(21.79,0.98) v1(23,37) v1(36,31.25) v1(36,17.25) v1(38.83,17.25) v1(43.75,27.75) v1(51,1) v1(54.1,9.13) v1(55,32.25) v1(55,28.67) v1(55,25.96) v1(55,23.31) v1(55,20.5) v1(55,13) v1(62,34) v1(69,13.75) v1(71.25,18.5) v1(76,35.25) v1(79.5,19.25) v1(80,7) v1(81,36.75) v1(82.25,27.5) v1(84.5,18) v1(85.57,25.25) v1(85.75,7) v1(86.5,23.5) v1(86.6,20.76) v1(88.11,26.75) v1(90,18.75) v1(92.25,14.5) v1(95.75,4.75) v1(97,11.25) v1(97.75,26.75) v1(98.75,5.5) v1(100.5,26.25) v1(100.75,13.75) v1(101.5,16.75) v1(104,21.5) v1(104.25,11) v1(104.58,13.43) v1(106,5.25) v1(106.75,8.25) v1(108.25,3) v1(108.5,19.5) v1(108.5,16.75) v1(111.75,16.75) v1(112.77,5) v1(114.05,32.18) v1(114.3,27.98) v1(115,32.2) v1(115.5,16.5) v1(115.5,4.5) v1(115.75,21) v1(116.25,20.25) v1(116.65,21.04) v1(116.75,3.25) v1(117.53,31.5) v1(118.5,6.75) v1(120,8) v1(121.25,22.5) v1(122,18.5) v1(129,4.5) v1(130.25,3.25) v1(134.72,6.65) v1(137.87,6.65) v1(142,15.75) v1(142,12.25) v1(145.5,4.5) v1(146.4,6.65) v1(146.54,3.25) v1(148.54,13.25) v1(149.25,22.25) v1(149.25,18.75) v1(149.62,6.65) v1(149.82,14.48) v1(149.8,12.07) v1(150.5,23.42) v1(151.75,22.25) v1(151.75,18.75) v1(154.25,15.75) v1(156.93,4.52) v1(157.68,10.8) v1(157.75,18.75) v1(158.04,6.65) v1(158.09,3.25) v1(159,15.75) v1(161.17,6.65) v1(168.5,4.5) v1(169.46,6.65) v1(169.5,3.25) v1(172.92,6.65) v1(173.75,19) v1(180,4.5) v1(181.25,3.25) v1(186,1) v1(189,37)
CARD_CS: length 33.6
  Top Layer w0.254: v1(42.33,27.88) 41.86,28.35 P3.10
  Top Layer w0.305: v1(42.33,23.52) 48.22,17.63 55.25,17.63 H1.6 67,19.38
  Bottom Layer w0.305: v1(42.33,27.88) 42.33,27.87 v1(42.33,23.52)
DC: length 34.8
  Top Layer w0.254: 40.35,25.49 40.35,29.29
  Top Layer w0.305: 67,16.84 H1.7 47.66,16.84 40.35,24.15 v1(40.35,25.49)
INT2: length 27.7
  Top Layer w0.305: P1.2 107.25,29.83 107.25,10.25 105.07,8.08 U2.13
LED_DATA: length 15.4
  Top Layer w0.305: P1.8 109.23,22.52 109.75,22 109.75,9 R1.2
LITE: length 33.3
  Top Layer w0.254: 38.91,33.5 37.85,32.44 37.85,29.29
  Top Layer w0.3: 38.91,33.5 55.58,33.5 H1.1
  Top Layer w0.305: H1.1 67,32.08
MISO: length 28.5
  Top Layer w0.254: P3.6 39.86,30.03 40.17,30.35
  Top Layer w0.305: 40.17,30.35 47.13,30.35 v1(47.93,29.54) ; H1.2 67,29.54
  Bottom Layer w0.305: H1.2 47.93,29.54 v1(47.93,29.54)
MOSI: length 31.9
  Top Layer w0.254: 40,31 39.35,30.35 39.35,29.12 P3.5
  Top Layer w0.305: 40,31 48,31 54.54,24.46 H1.4 67,24.46
RESET: length 24
  Top Layer w0.305: v1(94.71,15.11) 99.25,10.57 99.25,7 100.78,5.47 U2.9 ; v1(90.61,19.71) 90.61,20.39 89.49,21.51 U1.17
  Bottom Layer w0.305: v1(94.71,15.11) 94.71,15.61 v1(90.61,19.71)
RESET_TFT: length 36.1
  Top Layer w0.254: 42.24,25.01 40.85,26.4 40.85,29.29
  Top Layer w0.305: H1.8 67,14.3 ; 42.24,25.01 48.75,18.5 v1(54.5,18.5)
  Bottom Layer w0.305: v1(54.5,18.5) 54.5,15 55.25,14.25 56.95,14.25 H1.8
SCL: length 114.9
  Top Layer w0.305: U1.18 v1(90,22.16) ; U2.14 104.72,8.72 106.5,10.5 v1(106.5,26.75) 106.5,31.5 108.75,33.75 116.75,33.75 121.25,29.25 121.25,25.25 118.75,22.75 118.75,18.5 127.25,10 146.25,10 147.5,11.25 147.5,13.75 148.39,14.64 U3.10
  Bottom Layer w0.305: P1.6 106.5,26.73 ; v1(90,22.16) 92.34,24.5 104.25,24.5 v1(106.5,26.75)
SCLK: length 32.2
  Top Layer w0.254: 39.75,31.75 38.85,30.85 38.85,29.12 P3.4
  Top Layer w0.305: 67,27 H1.3 55.25,27 50.5,31.75 39.75,31.75
SDA: length 116.7
  Top Layer w0.305: v1(90,24.25) 90,23.31 89.5,22.81 U1.19 ; U3.9 147.25,16 146.75,15.5 146.75,11.75 145.75,10.75 127.5,10.75 119.5,18.75 119.5,22.25 122,24.75 122,29.75 117.25,34.5 108.25,34.5 105.75,32 v1(105.75,28.27) 105.75,10.75 104.38,9.38 U2.15
  Bottom Layer w0.305: v1(90,24.25) 91,25.25 102.73,25.25 v1(105.75,28.27) 106.75,29.27 P1.4
TFT_CS: length 29.7
  Top Layer w0.254: 41.55,27.36 41.35,27.56 41.35,29.29
  Top Layer w0.305: 41.55,27.36 46.99,21.92 H1.5 67,21.92
$1N1414: length 6.4
  Top Layer w0.305: R1.1 108.25,9 108.25,5.05 106.55,3.35
$1N1465: length 10
  Top Layer w0.305: v1(112.84,6.65) 111.45,6.65 ; 120.05,3.35 119.72,3.35 v1(116.42,6.65)
  Bottom Layer w0.305: v1(116.42,6.65) v1(112.84,6.65)
$1N1471: length 13
  Top Layer w0.305: 136.55,3.35 135.9,3.35 132.6,6.65 124.95,6.65
$1N1478: length 8
  Top Layer w0.305: 148.05,3.35 147.8,3.35 144.5,6.65 141.45,6.65
$1N1485: length 8
  Top Layer w0.305: 152.95,6.65 156.25,6.65 159.55,3.35
$1N1492: length 8
  Top Layer w0.305: 164.45,6.65 167.75,6.65 171.05,3.35
$1N2339: length 7.2
  Top Layer w0.254: R16.2 155.25,15 155.25,16 154.25,17 U3.4
  Top Layer w0.305: C16.2 156.25,12.3 R16.2
$1N2349: length 5.4
  Top Layer w0.254: U3.5 R17.2
  Top Layer w0.305: C17.2 156.25,15.8 R17.2
$1N2354: length 5.4
  Top Layer w0.254: U3.6 R18.2
  Top Layer w0.305: R18.2 144.75,15.8 C18.2
$1N3651: length 2
  Top Layer w0.305: U1.1 82.57,24 83,24.43 R6.2
$1N3862: length 34.4
  Top Layer w0.305: v1(101.75,11.03) 101.75,13.75 102.75,14.75 R11.2 103.66,17.16 103.66,20.09 99.04,24.71 SW1.2 ; U2.10 v1(104.5,6.12)
  Bottom Layer w0.305: v1(101.75,11.03) 101.75,8.88 v1(104.5,6.12)
$1N3864: length 4.5
  Top Layer w0.305: 98.94,17.75 99.04,17.85 SW1.B ; 98.94,17.75 R7.2 ; 98.94,17.75 97.5,17.75
$1N3866: length 4.5
  Top Layer w0.305: SW1.A 93.96,17.85 94.06,17.75 ; R8.1 94.06,17.75 ; 94.06,17.75 95.5,17.75
$1N3870: length 15.8
  Top Layer w0.305: 95.42,16.25 100,11.66 100,7.5 100.72,6.78 U2.11 ; 95.42,16.25 R10.2 ; 95.42,16.25 94.2,16.25 C15.2
$1N3872: length 12.6
  Top Layer w0.305: U2.12 101.57,7.42 100.75,8.25 100.75,12 99.3,13.45 C14.2 98.8,16.25 R9.1
$1N4065: length 116.9
  Top Layer w0.305: R2.1 v1(94.72,10.78) 95.89,9.62 95.89,8.4 96.21,8.08 U2.4 ; v1(12.75,12.5) 13.5,13.25 50.25,13.25 51.75,11.75 51.75,9 58.75,2 69.25,2 72.75,5.5 v1(81.5,5.5)
  Bottom Layer w0.305: v1(81.5,5.5) 87.75,5.5 93.03,10.78 v1(94.72,10.78) ; v1(12.75,12.5) 12.75,27.75 SW2.3
$1N4070: length 101.8
  Top Layer w0.305: R3.1 v1(95,8.5) 95,8 95.57,7.42 U2.5 ; v1(13.34,11.59) 14.25,12.5 50,12.5 51,11.5 51,8.75 58.5,1.25 69.5,1.25 73,4.75 v1(82.25,4.75)
  Bottom Layer w0.305: v1(95,8.5) 91.75,8.5 88,4.75 v1(82.25,4.75) ; v1(13.34,11.59) 12.31,11.59 11.75,12.15 11.75,13.75 SW3.3
$1N4076: length 37.7
  Top Layer w0.305: v1(84.5,15.5) 87.25,15.5 91.25,11.5 v1(91.25,6.78) ; U2.6 v1(94.73,6.78) R4.2 ; SW4.3 80.5,29 v1(80.5,20.25)
  Bottom Layer w0.305: v1(94.73,6.78) v1(91.25,6.78) ; v1(80.5,20.25) 80.5,19.5 v1(84.5,15.5)
$1N4082: length 25.3
  Top Layer w0.305: U2.7 95.62,6.12 95.25,5.75 R5.1 93.5,5.75 92.95,5.2 92.95,5.19 92.6,4.84 85.91,4.84 81.75,9 81.75,12.75 SW5.3
$1N4405: length 101.1
  Top Layer w0.305: v1(84.5,20.5) 84.21,20.21 U1.6
  Bottom Layer w0.305: v1(84.5,20.5) 84.5,30.5 77.5,37.5 25.5,37.5 19.5,31.5 12.5,31.5 11.5,32.5 8.5,32.5 7,31 7,29.25 5.75,28 SW2.6
$1N4413: length 123.5
  Top Layer w0.305: v1(19.72,30.37) 14.67,30.37 11.2,33.83 3.81,33.83 1.68,31.7 1.68,14.32 3,13 SW3.6 ; U1.7 84.19,19.56 v1(84.5,19.25)
  Bottom Layer w0.305: v1(19.72,30.37) 26.11,36.75 64,36.75 64.25,37 69.25,37 69.5,36.75 77,36.75 83.5,30.25 83.5,20.25 v1(84.5,19.25)
$1N4423: length 18.7
  Top Layer w0.305: U1.9 77.49,18.26 71.25,24.5 71.25,27 72.25,28 SW4.6
$1N4431: length 17.2
  Top Layer w0.305: U1.10 72.11,17.61 71,16.5 71,13.75 71.75,13 SW5.6
$1N7663: length 7
  Top Layer w0.254: R19.2 146,15.25 146,15.79 147.21,17 U3.7
  Top Layer w0.305: R19.2 144.75,12.3 C19.2
$1N7666: length 22.4
  Top Layer w0.305: RV1.2 130,14 R19.1
$1N7676: length 22.4
  Top Layer w0.305: RV4.2 171,14 R16.1
$1N7681: length 3.7
  Top Layer w0.305: RV3.2 159.5,19.25 R17.1
$1N7687: length 3.7
  Top Layer w0.305: RV2.2 141.5,19.25 R18.1

## Copper pours and planes (outline as drawn; the poured copper is in the pictures)
GND on Top Layer: 0.08,37.57 190.08,37.57 190.08,-0.18 0.08,-0.18
GND on Bottom Layer: 0,38 190,38 190,0.25 0,0.25

## Text on the board
Bottom Silkscreen Layer: LITE | MISO | SCLK | MOSI | CS_D | CS_C | DC | Reset | 5V | GND | ZC95 FrontPanelControls v1.1 by rootuz
Top Silkscreen Layer: Adafruit FFC (EYESPI) | SDA | SCL | GND | 3V3 | 5V
